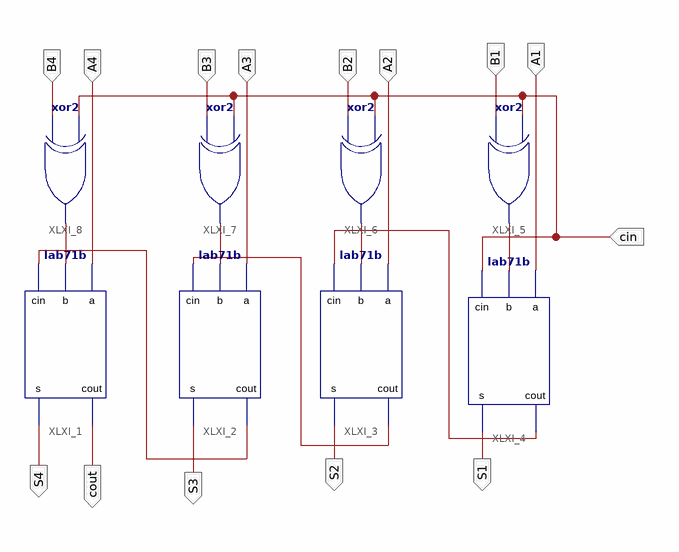
[diagram p0: schematic sheet 1]
// Xilinx ISE schematic lab72bsch.sch (artix7) as structural Verilog: 8 symbols, 14 ports
module lab72bsch (
  input  cin,
  input  A1,
  input  B1,
  input  A4,
  input  B4,
  input  B3,
  input  A3,
  input  B2,
  input  A2,
  output S1,
  output S2,
  output S3,
  output S4,
  output cout
);

  wire XLXN_2, XLXN_6, XLXN_8, XLXN_9, XLXN_10, XLXN_20, XLXN_22;

  lab71b XLXI_1 (.a(A4), .b(XLXN_10), .cin(XLXN_20), .cout(cout), .s(S4));
  lab71b XLXI_2 (.a(A3), .b(XLXN_9), .cin(XLXN_22), .cout(XLXN_20), .s(S3));
  lab71b XLXI_3 (.a(A2), .b(XLXN_8), .cin(XLXN_6), .cout(XLXN_22), .s(S2));
  lab71b XLXI_4 (.a(A1), .b(XLXN_2), .cin(cin), .cout(XLXN_6), .s(S1));
  xor XLXI_5 (XLXN_2, B1, cin);
  xor XLXI_6 (XLXN_8, B2, cin);
  xor XLXI_7 (XLXN_9, B3, cin);
  xor XLXI_8 (XLXN_10, B4, cin);
endmodule
